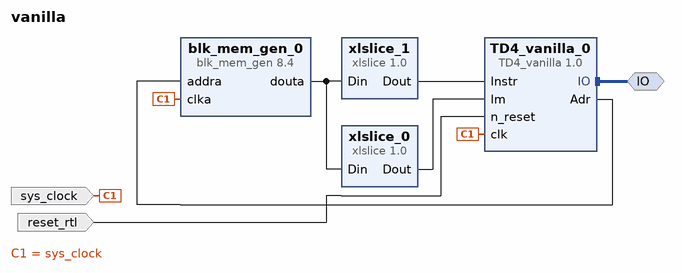
[diagram p0: block diagram of the top level]
# Vivado block design vanilla, xc7z020clg484-1, Vivado 2018.2
create_bd_design vanilla

create_bd_intf_port -mode Master -vlnv xilinx.com:user:IO_rtl:1.0 IO
create_bd_port -dir I -type rst reset_rtl
set_property -dict {CONFIG.POLARITY ACTIVE_HIGH} [get_bd_ports reset_rtl]
create_bd_port -dir I -type clk sys_clock
set_property -dict {CONFIG.FREQ_HZ 100000000 CONFIG.PHASE 0.000} [get_bd_ports sys_clock]

create_bd_cell -type ip -vlnv xilinx.com:ip:blk_mem_gen:8.4 blk_mem_gen_0
set_property -dict [list \
  CONFIG.Memory_Type Single_Port_ROM \
  CONFIG.Enable_32bit_Address false \
  CONFIG.Write_Width_A 8 \
  CONFIG.Write_Depth_A 16 \
  CONFIG.Enable_A Always_Enabled \
  CONFIG.Register_PortA_Output_of_Memory_Primitives false \
  CONFIG.Use_RSTA_Pin false \
  CONFIG.Port_A_Write_Rate 0 \
  CONFIG.use_bram_block Stand_Alone \
] [get_bd_cells blk_mem_gen_0]
create_bd_cell -type ip -vlnv xilinx.com:ip:xlslice:1.0 xlslice_0
set_property -dict {CONFIG.DIN_TO 0 CONFIG.DIN_FROM 3 CONFIG.DIN_WIDTH 8 CONFIG.DOUT_WIDTH 4} [get_bd_cells xlslice_0]
create_bd_cell -type ip -vlnv xilinx.com:ip:xlslice:1.0 xlslice_1
set_property -dict {CONFIG.DIN_TO 4 CONFIG.DIN_FROM 7 CONFIG.DIN_WIDTH 8 CONFIG.DOUT_WIDTH 4} [get_bd_cells xlslice_1]
create_bd_cell -type ip -vlnv xilinx.com:user:TD4_vanilla:1.0 TD4_vanilla_0

# ---- connections ----

connect_bd_intf_net [get_bd_intf_ports IO] [get_bd_intf_pins TD4_vanilla_0/IO]
connect_bd_net [get_bd_ports reset_rtl] [get_bd_pins TD4_vanilla_0/n_reset]
connect_bd_net [get_bd_pins blk_mem_gen_0/douta] [get_bd_pins xlslice_0/Din] [get_bd_pins xlslice_1/Din]
connect_bd_net [get_bd_pins xlslice_0/Dout] [get_bd_pins TD4_vanilla_0/Im]
connect_bd_net [get_bd_pins xlslice_1/Dout] [get_bd_pins TD4_vanilla_0/Instr]
connect_bd_net [get_bd_ports sys_clock] [get_bd_pins blk_mem_gen_0/clka] [get_bd_pins TD4_vanilla_0/clk]
connect_bd_net [get_bd_pins TD4_vanilla_0/Adr] [get_bd_pins blk_mem_gen_0/addra]

validate_bd_design
save_bd_design
